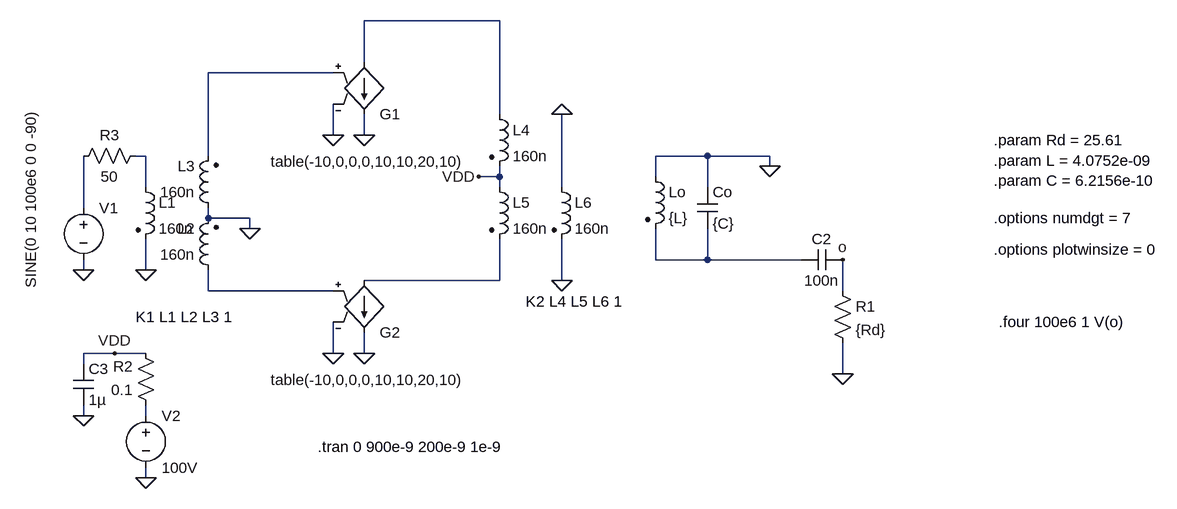
[diagram p0: schematic push_pull.asc]
push_pull.asc, the LTspice schematic file:
Version 4
SHEET 1 880 680
WIRE -672 -256 -880 -256
WIRE -880 -192 -880 -256
WIRE -928 -176 -1120 -176
WIRE -672 -112 -672 -256
WIRE -928 -80 -928 -128
WIRE -880 -80 -880 -112
WIRE -1216 -48 -1232 -48
WIRE -1120 -48 -1120 -176
WIRE -352 -48 -432 -48
WIRE -256 -48 -352 -48
WIRE -256 -32 -256 -48
WIRE -672 -16 -672 -32
WIRE -672 -16 -704 -16
WIRE -432 -16 -432 -48
WIRE -1216 0 -1216 -48
WIRE -672 0 -672 -16
WIRE -576 0 -576 -112
WIRE -352 0 -352 -48
WIRE -1312 32 -1312 -48
WIRE -1120 48 -1120 32
WIRE -1056 48 -1120 48
WIRE -1056 64 -1056 48
WIRE -432 112 -432 64
WIRE -352 112 -352 64
WIRE -352 112 -432 112
WIRE -208 112 -352 112
WIRE -1312 128 -1312 112
WIRE -1216 128 -1216 80
WIRE -672 144 -672 80
WIRE -672 144 -880 144
WIRE -576 144 -576 80
WIRE -1120 160 -1120 128
WIRE -928 160 -1120 160
WIRE -144 160 -144 112
WIRE -1264 256 -1312 256
WIRE -1216 256 -1264 256
WIRE -928 256 -928 208
WIRE -880 256 -880 224
WIRE -1312 272 -1312 256
WIRE -144 288 -144 240
WIRE -1312 352 -1312 336
WIRE -1216 352 -1216 336
WIRE -1216 448 -1216 432
FLAG -880 -80 0
FLAG -144 288 0
FLAG -928 -80 0
FLAG -1312 128 0
FLAG -1216 448 0
FLAG -144 112 o
FLAG -1312 352 0
FLAG -1216 128 0
FLAG -1056 64 0
FLAG -880 256 0
FLAG -928 256 0
FLAG -1264 256 VDD
FLAG -704 -16 VDD
FLAG -256 -32 0
FLAG -576 144 0
FLAG -576 -112 0
SYMBOL voltage -1312 16 R0
WINDOW 3 -81 140 VLeft 2
WINDOW 123 0 0 Left 2
WINDOW 39 0 0 Left 2
SYMATTR Value SINE(0 10 100e6 0 0 -90)
SYMATTR InstName V1
SYMBOL ind2 -448 -32 R0
SYMATTR InstName Lo
SYMATTR Value {L}
SYMATTR Type ind
SYMBOL cap -368 0 R0
SYMATTR InstName Co
SYMATTR Value {C}
SYMBOL cap -144 96 R90
WINDOW 0 0 32 VBottom 2
WINDOW 3 32 32 VTop 2
SYMATTR InstName C2
SYMATTR Value 100n
SYMBOL voltage -1216 336 R0
WINDOW 123 0 0 Left 2
WINDOW 39 0 0 Left 2
SYMATTR InstName V2
SYMATTR Value 100V
SYMBOL res -160 144 R0
SYMATTR InstName R1
SYMATTR Value {Rd}
SYMBOL g2 -880 -96 M180
WINDOW 3 -144 -57 Left 2
SYMATTR Value table(-10,0,0,0,10,10,20,10)
SYMATTR InstName G1
SYMBOL cap -1328 272 R0
SYMATTR InstName C3
SYMATTR Value 1µ
SYMBOL res -1200 352 R180
WINDOW 0 36 76 Left 2
WINDOW 3 36 40 Left 2
SYMATTR InstName R2
SYMATTR Value 0.1
SYMBOL ind2 -1232 -16 R0
SYMATTR InstName L1
SYMATTR Value 160n
SYMATTR Type ind
SYMBOL ind2 -1104 48 R180
WINDOW 0 36 80 Left 2
WINDOW 3 36 40 Left 2
SYMATTR InstName L3
SYMATTR Value 160n
SYMATTR Type ind
SYMBOL ind2 -1104 144 R180
WINDOW 0 36 80 Left 2
WINDOW 3 36 40 Left 2
SYMATTR InstName L2
SYMATTR Value 160n
SYMATTR Type ind
SYMBOL g2 -880 240 M180
WINDOW 3 -144 -57 Left 2
SYMATTR Value table(-10,0,0,0,10,10,20,10)
SYMATTR InstName G2
SYMBOL ind2 -688 -128 R0
SYMATTR InstName L4
SYMATTR Value 160n
SYMATTR Type ind
SYMBOL ind2 -688 -16 R0
SYMATTR InstName L5
SYMATTR Value 160n
SYMATTR Type ind
SYMBOL res -1216 -64 R90
WINDOW 0 0 56 VBottom 2
WINDOW 3 32 56 VTop 2
SYMATTR InstName R3
SYMATTR Value 50
SYMBOL ind2 -592 -16 R0
SYMATTR InstName L6
SYMATTR Value 160n
SYMATTR Type ind
TEXT -952 400 Left 2 !.tran 0 900e-9 200e-9 1e-9
TEXT 88 -72 Left 2 !.param Rd = 25.61\n.param L = 4.0752e-09\n.param C = 6.2156e-10
TEXT 88 48 Left 2 !.options numdgt = 7
TEXT 88 96 Left 2 !.options plotwinsize = 0
TEXT 96 208 Left 2 !.four 100e6 1 V(o)
TEXT -1232 200 Left 2 !K1 L1 L2 L3 1
TEXT -632 176 Left 2 !K2 L4 L5 L6 1

The netlist it stands for:
* push_pull.asc
V1 N004 0 SINE(0 10 100e6 0 0 -90)
Lo 0 N005 {L}
Co 0 N005 {C}
C2 o N005 100n
V2 N008 0 100V
R1 o 0 {Rd}
G1 N001 0 N002 0 table(-10,0,0,0,10,10,20,10)
C3 VDD 0 1µ
R2 N008 VDD 0.1
L1 N003 0 160n
L3 0 N002 160n
L2 N007 0 160n
G2 N006 0 N007 0 table(-10,0,0,0,10,10,20,10)
L4 N001 VDD 160n
L5 VDD N006 160n
R3 N003 N004 50
L6 0 0 160n
.tran 0 900e-9 200e-9 1e-9
.param Rd = 25.61
.param L = 4.0752e-09
.param C = 6.2156e-10
.options numdgt = 7
.options plotwinsize = 0
.four 100e6 1 V(o)
K1 L1 L2 L3 1
K2 L4 L5 L6 1
.backanno
.end